# Altium schematic sheet Microcontroller_sch_v22_1.SchDoc
size 228 x 123 mm; Origin: Eagle
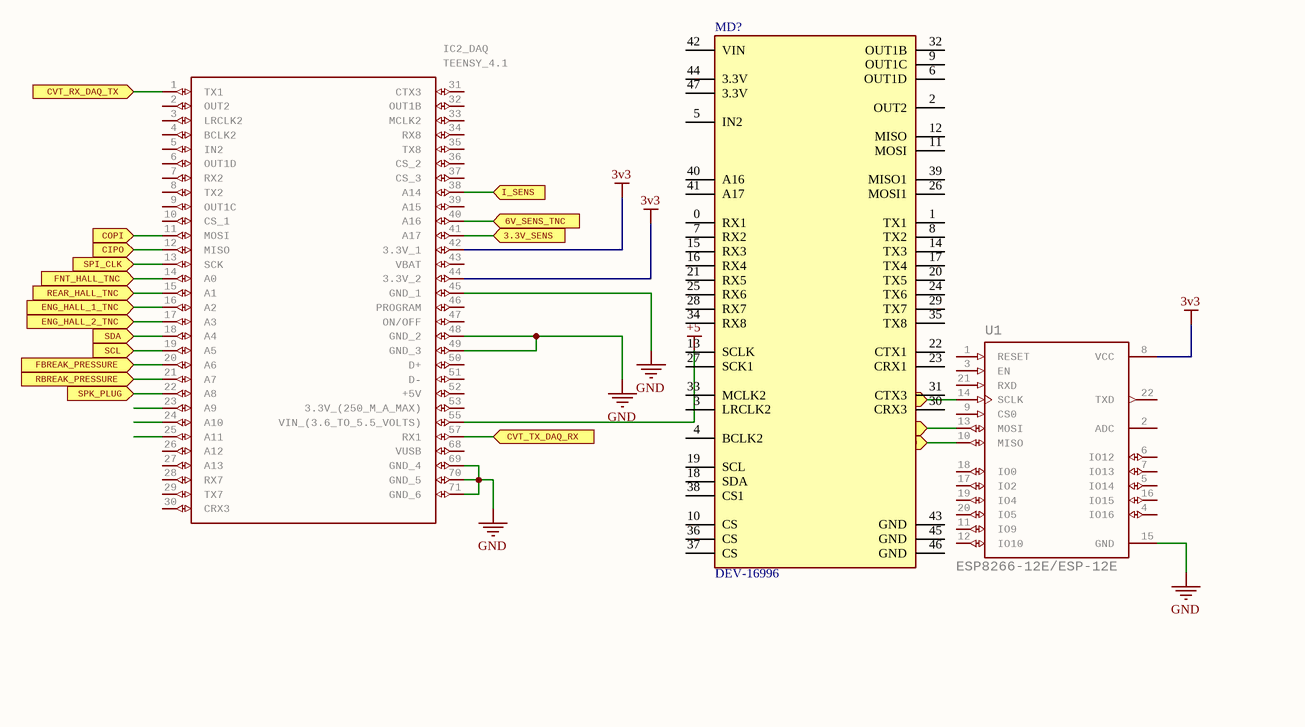
[diagram p0: Microcontroller_sch_v22_1.SchDoc]

## Parts
IC2_DAQ  TEENSY_4.1  [TEENSY41]
MD?  DEV-16996  [FP-DEV-16996-MFG]
U1  ESP8266-12E/ESP-12E  [XCVR_ESP8266-12E$ESP-12E]

## Ports
3.3V_SENS (in, see Microcontroller_sch_v22_2[2E]), 6V_SENS_TNC (in, see Microcontroller_sch_v22_3[2B]), CIPO (in, see Microcontroller_sch_v22_0[1B], Microcontroller_sch_v22_1[1B], Microcontroller_sch_v22_4[3C], Microcontroller_sch_v22_4[4C]), CIPO (in, see Microcontroller_sch_v22_0[1B], Microcontroller_sch_v22_1[5C], Microcontroller_sch_v22_4[3C], Microcontroller_sch_v22_4[4C]), COPI (in, see Microcontroller_sch_v22_0[1B], Microcontroller_sch_v22_1[1B], Microcontroller_sch_v22_4[2C], Microcontroller_sch_v22_4[4C]), COPI (in, see Microcontroller_sch_v22_0[1B], Microcontroller_sch_v22_1[5C], Microcontroller_sch_v22_4[2C], Microcontroller_sch_v22_4[4C]), CVT_RX_DAQ_TX (in, see Microcontroller_sch_v22_0[3C], Microcontroller_sch_v22_2[2C]), CVT_TX_DAQ_RX (in, see Microcontroller_sch_v22_0[1B], Microcontroller_sch_v22_2[2C]), ENG_HALL_1_TNC (in, see Microcontroller_sch_v22_0[1C], Microcontroller_sch_v22_3[5B]), ENG_HALL_2_TNC (in, see Microcontroller_sch_v22_0[1C], Microcontroller_sch_v22_3[6B]), FBREAK_PRESSURE (in, see Microcontroller_sch_v22_0[1C], Microcontroller_sch_v22_2[2D]), FNT_HALL_TNC (in, see Microcontroller_sch_v22_0[1C], Microcontroller_sch_v22_3[3B]), I_SENS (in, see Microcontroller_sch_v22_2[2E]), RBREAK_PRESSURE (in, see Microcontroller_sch_v22_0[1C], Microcontroller_sch_v22_2[2D]), REAR_HALL_TNC (in, see Microcontroller_sch_v22_0[1C], Microcontroller_sch_v22_3[4B]), SCL (in, see Microcontroller_sch_v22_0[1C], Microcontroller_sch_v22_0[4C], Microcontroller_sch_v22_2[2D]), SDA (in, see Microcontroller_sch_v22_0[1C], Microcontroller_sch_v22_0[4C], Microcontroller_sch_v22_2[2C]), SPI_CLK (in), SPI_CLK (in, see Microcontroller_sch_v22_0[1B], Microcontroller_sch_v22_1[4C], Microcontroller_sch_v22_2[4B], Microcontroller_sch_v22_4[2C], Microcontroller_sch_v22_4[4C]), SPK_PLUG (in, see Microcontroller_sch_v22_0[1C], Microcontroller_sch_v22_2[2D])

## Nets
3v3: IC2_DAQ.42(3.3V_1) IC2_DAQ.44(3.3V_2) U1.8(VCC)
+5: IC2_DAQ.55(VIN_(3.6_TO_5.5_VOLTS))
GND: IC2_DAQ.45(GND_1) IC2_DAQ.48(GND_2) IC2_DAQ.49(GND_3) IC2_DAQ.69(GND_4) IC2_DAQ.70(GND_5) IC2_DAQ.71(GND_6) U1.15(GND)
3.3V_SENS: IC2_DAQ.41(A17) ; port 3.3V_SENS
6V_SENS_TNC: IC2_DAQ.40(A16) ; port 6V_SENS_TNC
CIPO: IC2_DAQ.12(MISO) U1.10(MISO) ; port CIPO
COPI: IC2_DAQ.11(MOSI) U1.13(MOSI) ; port COPI
CVT_RX_DAQ_TX: IC2_DAQ.1(TX1) ; port CVT_RX_DAQ_TX
CVT_TX_DAQ_RX: IC2_DAQ.57(RX1) ; port CVT_TX_DAQ_RX
ENG_HALL_1_TNC: IC2_DAQ.16(A2) ; port ENG_HALL_1_TNC
ENG_HALL_2_TNC: IC2_DAQ.17(A3) ; port ENG_HALL_2_TNC
FBREAK_PRESSURE: IC2_DAQ.20(A6) ; port FBREAK_PRESSURE
FNT_HALL_TNC: IC2_DAQ.14(A0) ; port FNT_HALL_TNC
I_SENS: IC2_DAQ.38(A14) ; port I_SENS
RBREAK_PRESSURE: IC2_DAQ.21(A7) ; port RBREAK_PRESSURE
REAR_HALL_TNC: IC2_DAQ.15(A1) ; port REAR_HALL_TNC
SCL: IC2_DAQ.19(A5) ; port SCL
SDA: IC2_DAQ.18(A4) ; port SDA
SPI_CLK: IC2_DAQ.13(SCK) U1.14(SCLK) ; port SPI_CLK
SPK_PLUG: IC2_DAQ.22(A8) ; port SPK_PLUG

Not connected (* = marked no-connect by the designer): IC2_DAQ 2(OUT2) 3(LRCLK2) 4(BCLK2) 5(IN2) 6(OUT1D) 7(RX2) 8(TX2) 9(OUT1C) 10(CS_1) 23(A9) 24(A10) 25(A11) 26(A12) 27(A13) 28(RX7) 29(TX7) 30(CRX3) 31(CTX3) 32(OUT1B) 33(MCLK2) 34(RX8) 35(TX8) 36(CS_2) 37(CS_3) 39(A15) 43(VBAT) 46(PROGRAM) 47(ON/OFF) 50(D+) 51(D-) 52(+5V) 53(3.3V_(250_M_A_MAX)) 68(VUSB); MD? 0(RX1) 1(TX1) 2(OUT2) 3(LRCLK2) 4(BCLK2) 5(IN2) 6(OUT1D) 7(RX2) 8(TX2) 9(OUT1C) 10(CS) 11(MOSI) 12(MISO) 13(SCLK) 14(TX3) 15(RX3) 16(RX4) 17(TX4) 18(SDA) 19(SCL) 20(TX5) 21(RX5) 22(CTX1) 23(CRX1) 24(TX6) 25(RX6) 26(MOSI1) 27(SCK1) 28(RX7) 29(TX7) 30(CRX3) 31(CTX3) 32(OUT1B) 33(MCLK2) 34(RX8) 35(TX8) 36(CS) 37(CS) 38(CS1) 39(MISO1) 40(A16) 41(A17) 42(VIN) 43(GND) 44(3.3V) 45(GND) 46(GND) 47(3.3V); U1 1(RESET) 2(ADC) 3(EN) 4(IO16) 5(IO14) 6(IO12) 7(IO13) 9(CS0) 11(IO9) 12(IO10) 16(IO15) 17(IO2) 18(IO0) 19(IO4) 20(IO5) 21(RXD) 22(TXD)

## Library data of the parts
IC2_DAQ = TEENSY_4.1: Teensy 4.1 Development Board   Source:  Datasheet; MANUFACTURER_NAME: PJRC; GateName_1: G$1; SymbolName_1: TEENSY_4.1; LibraryName: TEENSY_4.1; DeviceSetName: TEENSY_4.1; ARROW_PART_NUMBER: ARROW_PART_NUMBER; ARROW_PRICE-STOCK: ARROW_PRICE-STOCK; HEIGHT: mm; MANUFACTURER_PART_NUMBER: TEENSY 4.1; MOUSER_PART_NUMBER: MOUSER_PART_NUMBER; MOUSER_PRICE-STOCK: MOUSER_PRICE-STOCK; MOUSER_TESTING_PART_NUMBER: MOUSER_TESTING_PART_NUMBER; MOUSER_TESTING_PRICE-STOCK: MOUSER_TESTING_PRICE-STOCK
MD? = CMP-157412-000001-1: TEENSY 4.1 (HEADERS)
U1 = ESP8266-12E/ESP-12E: ESP-12E WiFi Module Check availability; GateName_1: G$1; MF: AI-Thinker; SymbolName_1: ESP8266-12E/ESP-12E; LibraryName: ESP8266-12E_ESP-12E; DeviceSetName: ESP8266-12E/ESP-12E; AVAILABILITY: Not in stock; MP: ESP8266-12E/ESP-12E; PACKAGE: None; PRICE: None